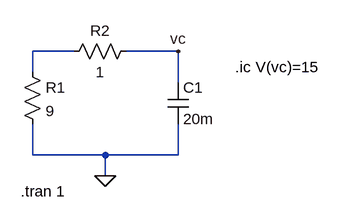
[diagram p0: schematic sadiku_chapter7_example_72_without_Source.asc]
sadiku_chapter7_example_72_without_Source.asc, the LTspice schematic file:
Version 4
SHEET 1 880 680
WIRE 112 80 48 80
WIRE 272 80 192 80
WIRE 48 112 48 80
WIRE 272 128 272 80
WIRE 48 240 48 192
WIRE 160 240 48 240
WIRE 272 240 272 192
WIRE 272 240 160 240
WIRE 160 272 160 240
FLAG 160 272 0
FLAG 272 80 vc
SYMBOL res 32 96 R0
SYMATTR InstName R1
SYMATTR Value 9
SYMBOL res 208 64 R90
WINDOW 0 0 56 VBottom 2
WINDOW 3 32 56 VTop 2
SYMATTR InstName R2
SYMATTR Value 1
SYMBOL cap 256 128 R0
SYMATTR InstName C1
SYMATTR Value 20m
TEXT 360 104 Left 2 !.ic V(vc)=15
TEXT 30 296 Left 2 !.tran 1

The netlist it stands for:
* sadiku_chapter7_example_72_without_Source.asc
R1 N001 0 9
R2 vc N001 1
C1 vc 0 20m
.ic V(vc)=15
.tran 1
.backanno
.end

* Results of the author's LTspice run, read from the files saved beside the schematic
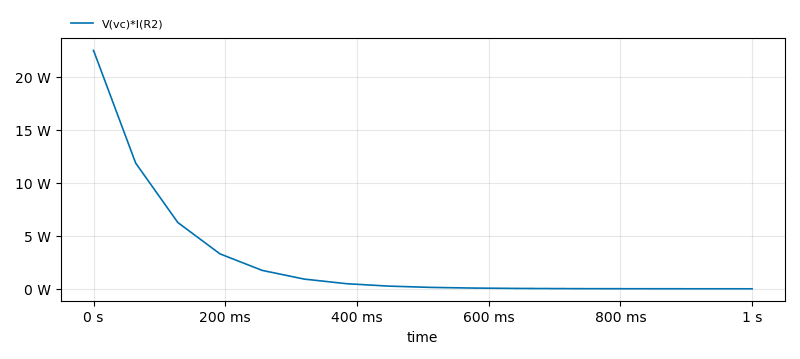
[diagram p1: Transient Analysis of sadiku_chapter7_example_72_without_Source.asc, plotted from the saved traces]
* Transient Analysis, 1 run:
*   V(vc)*I(R2): min 1.021 mW, max 22.5 W, average 2.326 W, rms 5.355 W, last 1.021 mW